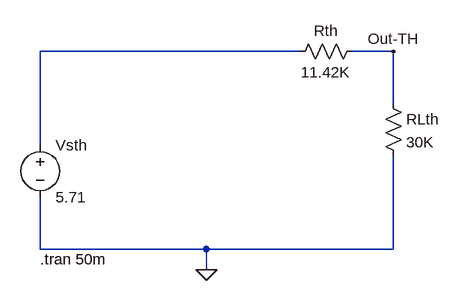
[diagram p0: schematic circuitTH.asc]
circuitTH.asc, the LTspice schematic file:
Version 4
SHEET 1 984 680
WIRE 512 -16 112 -16
WIRE 656 -16 592 -16
WIRE 656 64 656 -16
WIRE 112 128 112 -16
WIRE 112 288 112 208
WIRE 368 288 112 288
WIRE 656 288 656 144
WIRE 656 288 368 288
WIRE 368 320 368 288
FLAG 368 320 0
FLAG 656 -16 Out-TH
SYMBOL voltage 112 112 R0
WINDOW 123 0 0 Left 2
WINDOW 39 0 0 Left 2
SYMATTR InstName Vsth
SYMATTR Value 5.71
SYMBOL res 496 0 R270
WINDOW 0 32 56 VTop 2
WINDOW 3 0 56 VBottom 2
SYMATTR InstName Rth
SYMATTR Value 11.42K
SYMBOL res 640 48 R0
SYMATTR InstName RLth
SYMATTR Value 30K
TEXT 112 304 Left 2 !.tran 50m

The netlist it stands for:
* circuitTH.asc
Vsth N001 0 5.71
Rth N001 Out-TH 11.42K
RLth Out-TH 0 30K
.tran 50m
.backanno
.end